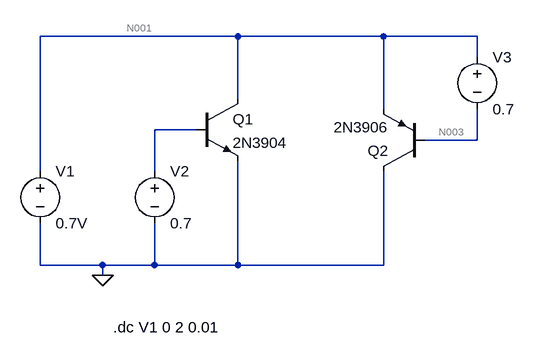
[diagram p0: schematic LT_CALIF_BJT.asc]
LT_CALIF_BJT.asc, the LTspice schematic file:
Version 4
SHEET 1 2404 1432
WIRE 768 -352 464 -352
WIRE 992 -352 768 -352
WIRE 1136 -352 992 -352
WIRE 1136 -320 1136 -352
WIRE 768 -256 768 -352
WIRE 992 -240 992 -352
WIRE 704 -208 640 -208
WIRE 1136 -192 1136 -240
WIRE 1136 -192 1056 -192
WIRE 464 -144 464 -352
WIRE 640 -144 640 -208
WIRE 464 0 464 -64
WIRE 560 0 464 0
WIRE 640 0 640 -64
WIRE 640 0 560 0
WIRE 768 0 768 -160
WIRE 768 0 640 0
WIRE 992 0 992 -144
WIRE 992 0 768 0
WIRE 560 16 560 0
FLAG 560 16 0
SYMBOL /npn 704 -256 R0
SYMATTR InstName Q1
SYMATTR Value 2N3904
SYMBOL /voltage 464 -160 R0
SYMATTR InstName V1
SYMATTR Value 0.7V
SYMBOL pnp 1056 -144 R180
SYMATTR InstName Q2
SYMATTR Value 2N3906
SYMBOL voltage 640 -160 R0
WINDOW 123 0 0 Left 0
WINDOW 39 0 0 Left 0
SYMATTR InstName V2
SYMATTR Value 0.7
SYMBOL voltage 1136 -336 R0
WINDOW 123 0 0 Left 0
WINDOW 39 0 0 Left 0
SYMATTR InstName V3
SYMATTR Value 0.7
TEXT 576 96 Left 2 !.dc V1 0 2 0.01

The netlist it stands for:
* LT_CALIF_BJT.asc
Q1 N001 N002 0 0 2N3904
V1 N001 0 0.7V
Q2 0 N003 N001 0 2N3906
V2 N002 0 0.7
V3 N001 N003 0.7
.model NPN NPN
.model PNP PNP
.lib standard.bjt
.dc V1 0 2 0.01
.backanno
.end

* Results of the author's LTspice run, read from the files saved beside the schematic
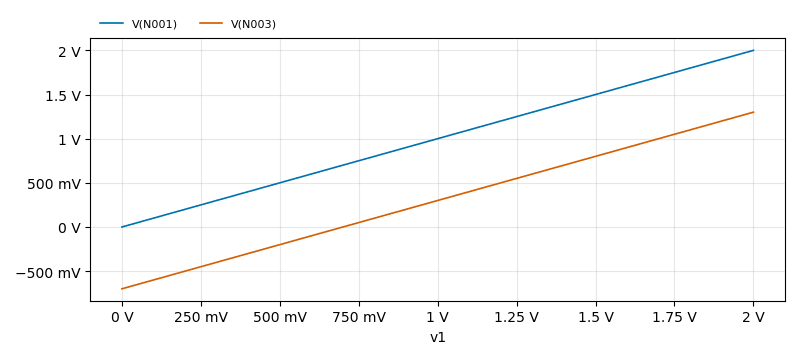
[diagram p1: DC transfer characteristic of LT_CALIF_BJT.asc, plotted from the saved traces]
* DC transfer characteristic, 1 run:
*   V(N001): 0 V at v1=0 V, 2 V at v1=2 V, min 0 V, max 2 V
*   V(N003): -700 mV at v1=0 V, 1.3 V at v1=2 V, min -700 mV, max 1.3 V